# EAGLE design Qwiic_Relay_v11 (EAGLE 7.7.0)
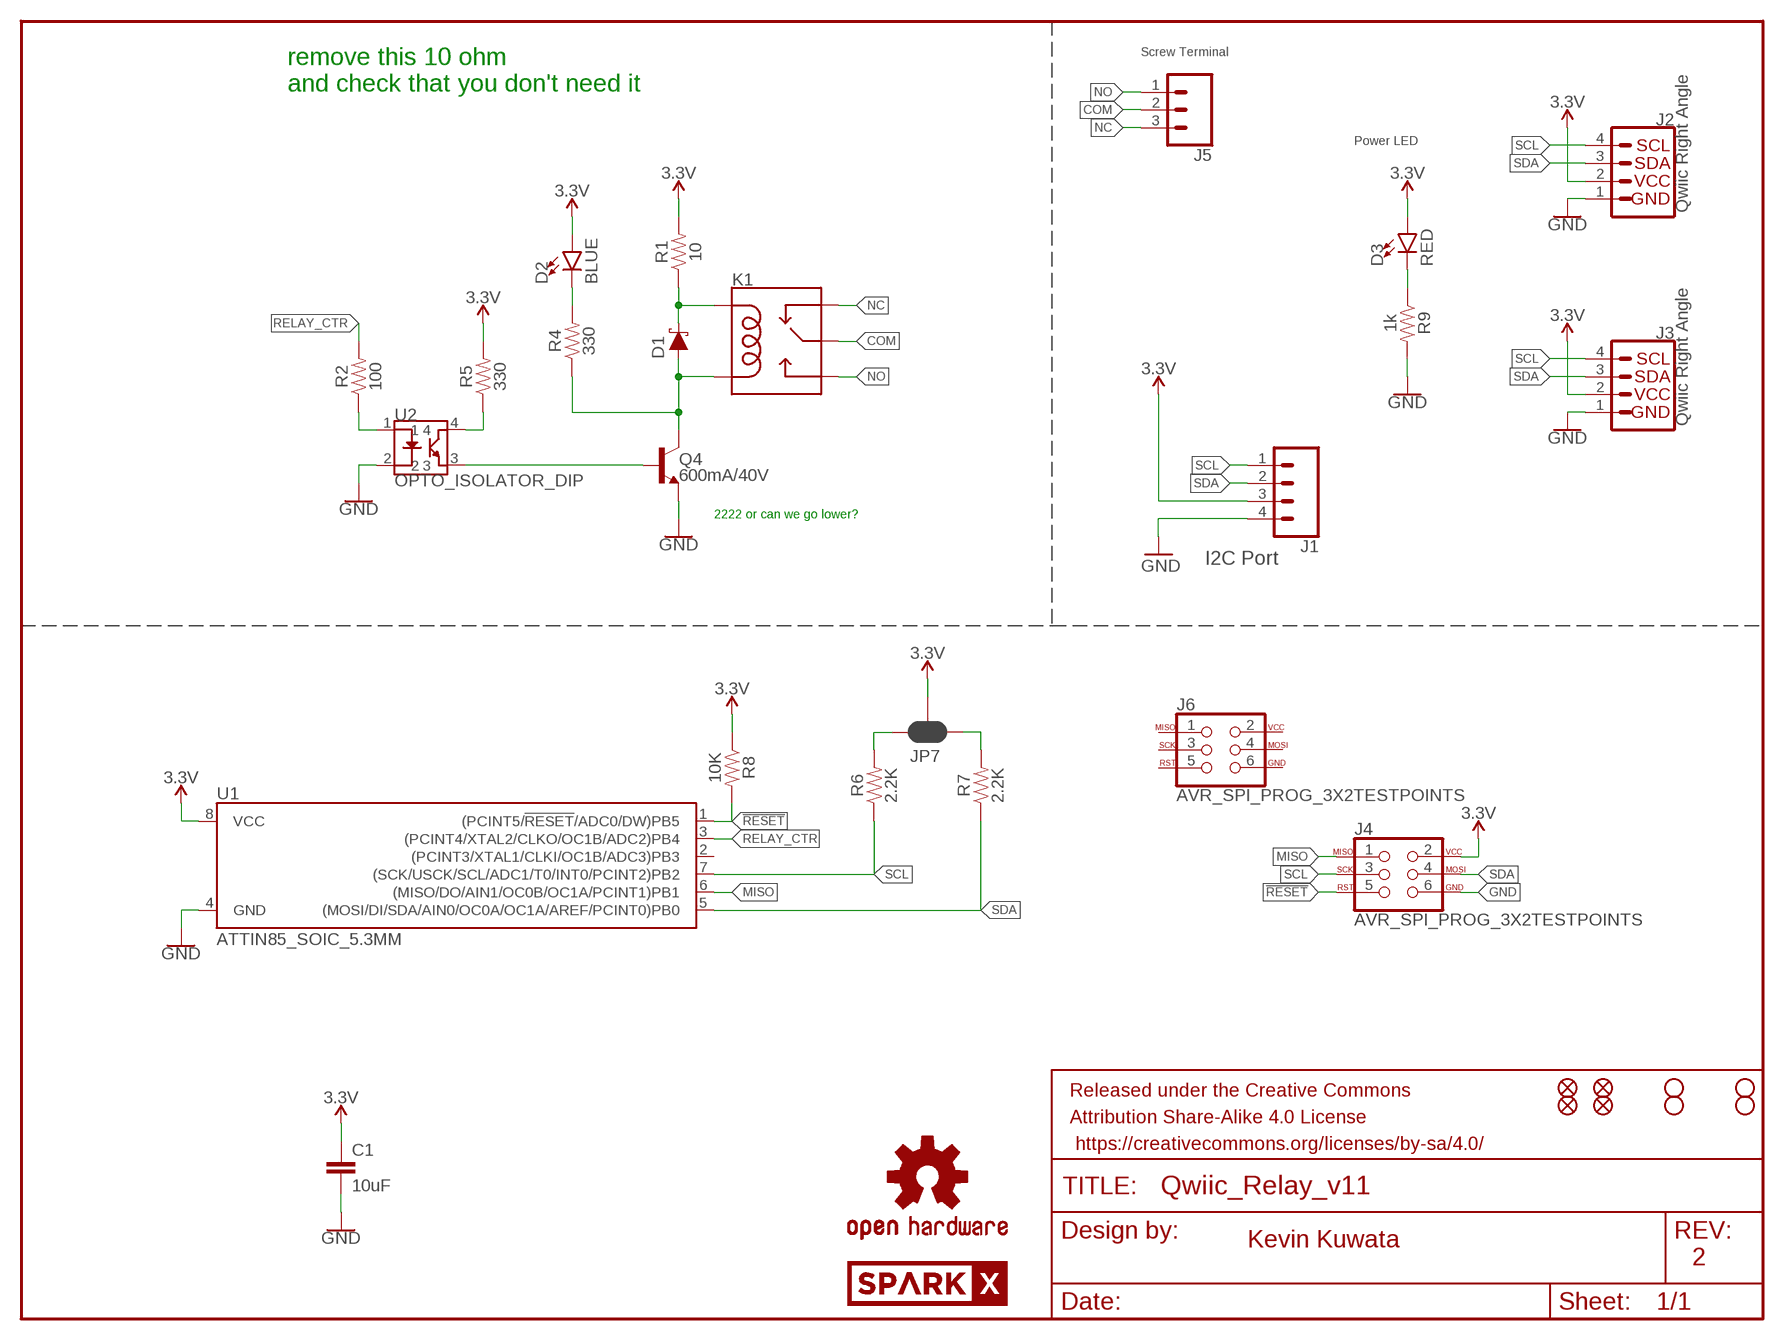
[diagram p0: schematic, sheet 1]

## Parts
C1  10uF  10UF-0603-6.3V-20%  [0603]
D1  1A/23V/620mV  DIODE-SCHOTTKY-BAT20J  [SOD-323]
D2  BLUE  LED-BLUE0603  [LED-0603]
D3  RED  LED-RED0603  [LED-0603]
FRAME1  FRAME-LETTER  [CREATIVE_COMMONS]
J1  CONN_041X04_NO_SILK  [1X04_NO_SILK]
J2  Qwiic Right Angle  I2C_STANDARDQWIIC  [1X04_1MM_RA]
J3  Qwiic Right Angle  I2C_STANDARDQWIIC  [1X04_1MM_RA]
J4  AVR_SPI_PROG_3X2TESTPOINTS  [2X3_TEST_POINTS]
J5  CONN_03-SCREW-5MM  [SCREWTERMINAL-5MM-3]
J6  AVR_SPI_PROG_3X2TESTPOINTS  [2X3_TEST_POINTS]
JP1  STAND-OFF  [STAND-OFF]
JP2  FIDUCIALUFIDUCIAL  [MICRO-FIDUCIAL]
JP3  STAND-OFF  [STAND-OFF]
JP4  STAND-OFF  [STAND-OFF]
JP5  STAND-OFF  [STAND-OFF]
JP6  FIDUCIALUFIDUCIAL  [MICRO-FIDUCIAL]
JP7  JUMPER-SMT_3_2-NC_PASTE_SILK  [SMT-JUMPER_3_2-NC_PASTE_SILK]
JP8  FIDUCIALUFIDUCIAL  [MICRO-FIDUCIAL]
JP9  FIDUCIALUFIDUCIAL  [MICRO-FIDUCIAL]
K1  RELAY_SPDT_1C  [RELAY_SPDT_1C]
LOGO1  OSHW-LOGOMINI  [OSHW-LOGO-MINI]
Q4  600mA/40V  TRANS_NPN-MMBT2222AL  [SOT23-3]
R1  10  47KOHM-0603-1/10W-1%  [0603]
R2  100  100OHM-0603-1/4W-5%  [0603]
R4  330  300OHM-0603-1/10W-1%  [0603]
R5  330  330OHM-0603-1/10W-1%  [0603]
R6  2.2K  4.7KOHM-0603-1/10W-1%  [0603]
R7  2.2K  4.7KOHM-0603-1/10W-1%  [0603]
R8  10K  330OHM-0603-1/10W-1%  [0603]
R9  1k  330OHM-0603-1/10W-1%  [0603]
U1  ATTIN85_SOIC_5.3MM  [ATTINY85]
U2  OPTO_ISOLATOR_DIP  [4PIN_DIP]
U$3  SPARKX-LOGO4  [SPARKX-MEDIUM]
U$4  SPARKX-LOGO4  [SPARKX-MEDIUM]

## Nets
3.3V: C1.1 D2.A D3.A J1.3 J2.2 J3.2 J4.2 JP7.2 R1.2 R5.2 R8.1 U1.8(VCC)
!RESET: J4.5 R8.2 U1.1((PCINT5/!RESET!/ADC0/DW)PB5)
COM: J5.2 K1.1(MAIN)
GND: C1.2 J1.4 J2.1 J3.1 J4.6 Q4.2(E) R9.2 U1.4(GND) U2.2
MISO: J4.1 U1.6((MISO/DO/AIN1/OC0B/OC1A/PCINT1)PB1)
N$1: Q4.1(B) U2.3
N$2: D1.A K1.5(COIL2) Q4.3(C) R4.1
N$3: R2.1 U2.1
N$4: JP7.1 R7.2
N$7: D1.C K1.2(COIL1) R1.1
N$8: D2.C R4.2
N$9: R5.1 U2.4
N$10: JP7.3 R6.2
N$13: D3.C R9.1
NC: J5.3 K1.4(NC)
NO: J5.1 K1.3(NO)
RELAY_CTR: R2.2 U1.3((PCINT4/XTAL2/CLKO/OC1B/ADC2)PB4)
SCL: J1.1 J2.4 J3.4 J4.3 R6.1 U1.7((SCK/USCK/SCL/ADC1/T0/INT0/PCINT2)PB2)
SDA: J1.2 J2.3 J3.3 J4.4 R7.1 U1.5((MOSI/DI/SDA/AIN0/OC0A/OC1A/AREF/PCINT0)PB0)
Unconnected: J6.1 J6.2 J6.3 J6.4 J6.5 J6.6 U1.2((PCINT3/XTAL1/CLKI/OC1B/ADC3)PB3)

## Notes on the sheet
- Screw Terminal
- remove this 10 ohm 
  and check that you don't need it
- Power LED
- 2222 or can we go lower?
- I2C Port
- Kevin Kuwata
- 2

## Library data of the parts
C1 = SparkFun-Capacitors:10UF: 10.0µF ceramic capacitors A capacitor is a passive two-terminal electrical component used to store electrical energy temporarily in an electric field.; PROD_ID: CAP-11015
D1 = SparkFun-DiscreteSemi:DIODE-SCHOTTKY: Schottky diode A Schottky diode is a semiconductor diode which has a low forward voltage drop and a very fast switching action.; PROD_ID: DIO-11623
D2 = SparkFun-LED:LED-BLUE: Blue SMD LED Used in manufacturing of various products at SparkFun Packages: 0603 - SMD 0603 package [Product Link] <http://www.digikey.com/product-detail/en/SMLE12BC7TT86/511-1589-2-ND/1641808> 1206 - SMD1206 package [Product Link] <http://www.digikey.com/product-detail/en/lite-on-inc/LTST-C150TBKT/160-1643-1-ND/573584> SparkFun Products: ESP8266 Thing-Dev Board <https://www.sparkfun.com/products/13711> RedBoard <https://www.sparkfun.com/products/12757>; PROD_ID: DIO-08575
D3 = SparkFun-LED:LED-RED: Red SMD LED Used in manufacturing of most products at SparkFun Packages: 0603 - SMD 0603 package [Product Link] <http://docs.avagotech.com/docs/AV02-0551EN> 0603 SMART - SMD 0603 SMART package ( more efficient and expensive)[Product Link] <http://www.osram-os.com/Graphics/XPic2/00077099_0.pdf> 1206 - SMD1206 package [Product Link] <https://www.sparkfun.com/datasheets/DevTools/LilyPad/Q150OVS4.pdff> SparkFun Products: Pro Mini 328 -5V <https://www.sparkfun.com/products/821> RedBoard <https://www.sparkfun.com/products/12757> IOIO-OTG <https://www.sparkfun.com/products/13613>; PROD_ID: DIO-00819
FRAME1 = SparkFun-Aesthetics:FRAME-LETTER: Schematic Frame - Letter Standard 8.5x11 US Letter frame
J1 = SparkFun-Connectors:CONN_04: Multi connection point. Often used as Generic Header-pin footprint for 0.1 inch spaced/style header connections On any of the 0.1 inch spaced packages, you can populate with these: Break Away Headers - Straight <https://www.sparkfun.com/products/116> (PRT-00116) Break Away Male Headers - Right Angle <https://www.sparkfun.com/products/553> (PRT-00553) Female Headers <https://www.sparkfun.com/products/115> (PRT-00115) Break Away Headers - Machine Pin <https://www.sparkfun.com/products/117> (PRT-00117) Break Away Female Headers - Swiss Machine Pin <https://www.sparkfun.com/products/743> (PRT-00743) For SCREWTERMINALS and SPRING TERMINALS visit here: Screw Terimnals on SparkFun.com <https://www.sparkfun.com/search/results?term=Screw+Terminals> (5mm/3.5mm/2.54mm spacing) This device is also useful as a general connection point to wire up your design to another part of your project. Our various solder wires solder well into these plated through hole pads. Hook-Up Wire - Assortment (Stranded, 22 AWG) <https://www.sparkfun.com/products/11375> (PRT-11375) Hook-Up Wire - Assortment (Solid Core, 22 AWG) <https://www.sparkfun.com/products/11367> (PRT-11367) View the entire wire category on our website here <https://www.sparkfun.com/categories/141> Special notes: Molex polarized connector foot print use with SKU : PRT-08231 with associated crimp pins and housings. 1MM SMD Version SKU: PRT-10208; PROD_ID: CONN-09696
J2 J3 = SparkFun-Connectors:I2C_STANDARD: SparkFun I2C Standard Pinout Header SparkFun has standardized on a pinout for all I2C based sensor breakouts. This pinout allows I2C boards to be plugged directly into the headers on Arduino Uno compatible boards, and to be daisy chained easily. Example SparkFun Products: SparkFun Atmospheric Sensor Breakout - BME280 <https://www.sparkfun.com/products/13676> SparkFun Altitude/Pressure Sensor Breakout - MPL3115A2 <https://www.sparkfun.com/products/11084> SparkFun TOF Range Finder Sensor - VL6180 <https://www.sparkfun.com/products/12785>; PROD_ID: CONN-13694
J4 J6 = SparkFun-Connectors:AVR_SPI_PROG_3X2: AVR ISP 6 Pin This is the reduced ISP connector for AVR programming. Common on Arduino. This footprint will take up less PCB space and can be used with a 10-pin to 6-pin adapter such as SKU: BOB-08508 **Special note about "TEST_POINT" package. The stop mask is on the top side, so if you want your programming test points to be on the bottom of your board, make sure to place this package on the bottom side of the board. This also ensure that the orientation to program from the bottom side will be correct. SparkFun Products: SparkFun ISP Pogo Adapter <https://www.sparkfun.com/products/11591> - NS Tiny AVR Programmer <https://www.sparkfun.com/products/11801> -PTH
J5 = SparkFun-Connectors:CONN_03: Multi connection point. Often used as Generic Header-pin footprint for 0.1 inch spaced/style header connections On any of the 0.1 inch spaced packages, you can populate with these: Break Away Headers - Straight <https://www.sparkfun.com/products/116> (PRT-00116) Break Away Male Headers - Right Angle <https://www.sparkfun.com/products/553> (PRT-00553) Female Headers <https://www.sparkfun.com/products/115> (PRT-00115) Break Away Headers - Machine Pin <https://www.sparkfun.com/products/117> (PRT-00117) Break Away Female Headers - Swiss Machine Pin <https://www.sparkfun.com/products/743> (PRT-00743) Stackable Header - 3 Pin (Female, 0.1") <https://www.sparkfun.com/products/13875> (PRT-13875) For SCREWTERMINALS and SPRING TERMINALS visit here: Screw Terimnals on SparkFun.com <https://www.sparkfun.com/search/results?term=Screw+Terminals> (5mm/3.5mm/2.54mm spacing) This device is also useful as a general connection point to wire up your design to another part of your project. Our various solder wires solder well into these plated through hole pads. Hook-Up Wire - Assortment (Stranded, 22 AWG) <https://www.sparkfun.com/products/11375> (PRT-11375) Hook-Up Wire - Assortment (Solid Core, 22 AWG) <https://www.sparkfun.com/products/11367> (PRT-11367) View the entire wire category on our website here <https://www.sparkfun.com/categories/141> Special notes: Molex polarized connector foot print use with SKU : PRT-08232 with associated crimp pins and housings.; PROD_ID: CONN-10134; SF_SKU: PRT-08433
JP1 JP3-JP5 = SparkFun:STAND-OFF: Stand Off This is the mechanical footprint for a #4 phillips button head screw. Use the keepout ring to avoid running the screw head into surrounding components. SKU : PRT-00447
JP2 JP6 JP8 JP9 = SparkFun:FIDUCIAL: Fiducial Alignment Points Various fiducial points for machine vision alignment.
JP7 = SparkFun-Jumpers:JUMPER-SMT_3_2-NC_PASTE: Normally closed solder jumper (2 of 2 connections) This jumper has an aperture in the stencil to allow solder paste to bridge both connections. Both connections are normally closed (NC). Wick off the solder to open the connection(s). Reapply solder to reclose the connection(s).
K1 = Relay_SPDT:RELAY_SPDT
LOGO1 = SparkFun-Aesthetics:OSHW-LOGO: Open-Source Hardware (OSHW) Logo This logo indicates the piece of hardware it is found on incorporates a OSHW license and/or adheres to the definition of open source hardware found here: http://freedomdefined.org/OSHW
Q4 = SparkFun-DiscreteSemi:TRANS_NPN: NPN transistor Current controlled devices typically used to amplify current or used as a switch. BC547 - COM-08928 <http://www.sparkfun.com/products/8928> (TO-92 45V 100mA) (1.Collector 2.Base 3.Emitter) 2N3904 - COM-00521 <http://www.sparkfun.com/products/521> (TO-92 40V 200mA) (1.Emitter 2.Base 3.Collector) P2N2222A - COM-12852 <http://www.sparkfun.com/products/12852> (TO-92 40V 600mA) (1.Collector 2.Base 3.Emitter); PROD_ID: TRANS-08049
R1 = SparkFun-Resistors:47KOHM: 47kΩ resistor A resistor is a passive two-terminal electrical component that implements electrical resistance as a circuit element. Resistors act to reduce current flow, and, at the same time, act to lower voltage levels within circuits. - Wikipedia; PROD_ID: RES-07871; VALUE: 47k
R2 = SparkFun-Resistors:100OHM: 100Ω resistor A resistor is a passive two-terminal electrical component that implements electrical resistance as a circuit element. Resistors act to reduce current flow, and, at the same time, act to lower voltage levels within circuits. - Wikipedia; PROD_ID: RES-12438
R4 = SparkFun-Resistors:300OHM: 300Ω resistor A resistor is a passive two-terminal electrical component that implements electrical resistance as a circuit element. Resistors act to reduce current flow, and, at the same time, act to lower voltage levels within circuits. - Wikipedia; PROD_ID: RES_10328; VALUE: 300
R5 = SparkFun-Resistors:330OHM: 330Ω resistor A resistor is a passive two-terminal electrical component that implements electrical resistance as a circuit element. Resistors act to reduce current flow, and, at the same time, act to lower voltage levels within circuits. - Wikipedia; PROD_ID: RES-00818
R6 R7 = SparkFun-Resistors:4.7KOHM: 4.7kΩ resistor A resistor is a passive two-terminal electrical component that implements electrical resistance as a circuit element. Resistors act to reduce current flow, and, at the same time, act to lower voltage levels within circuits. - Wikipedia; PROD_ID: RES-07857; VALUE: 4.7k
R8 R9 = SparkFun-Resistors:330OHM: 330Ω resistor A resistor is a passive two-terminal electrical component that implements electrical resistance as a circuit element. Resistors act to reduce current flow, and, at the same time, act to lower voltage levels within circuits. - Wikipedia; PROD_ID: RES-00818; VALUE: 330
U1 = attiny85:ATTIN85
U2 = LTV-816:OPTO_ISOLATOR
U$3 U$4 = SparkX:SPARKX-LOGO

## Board
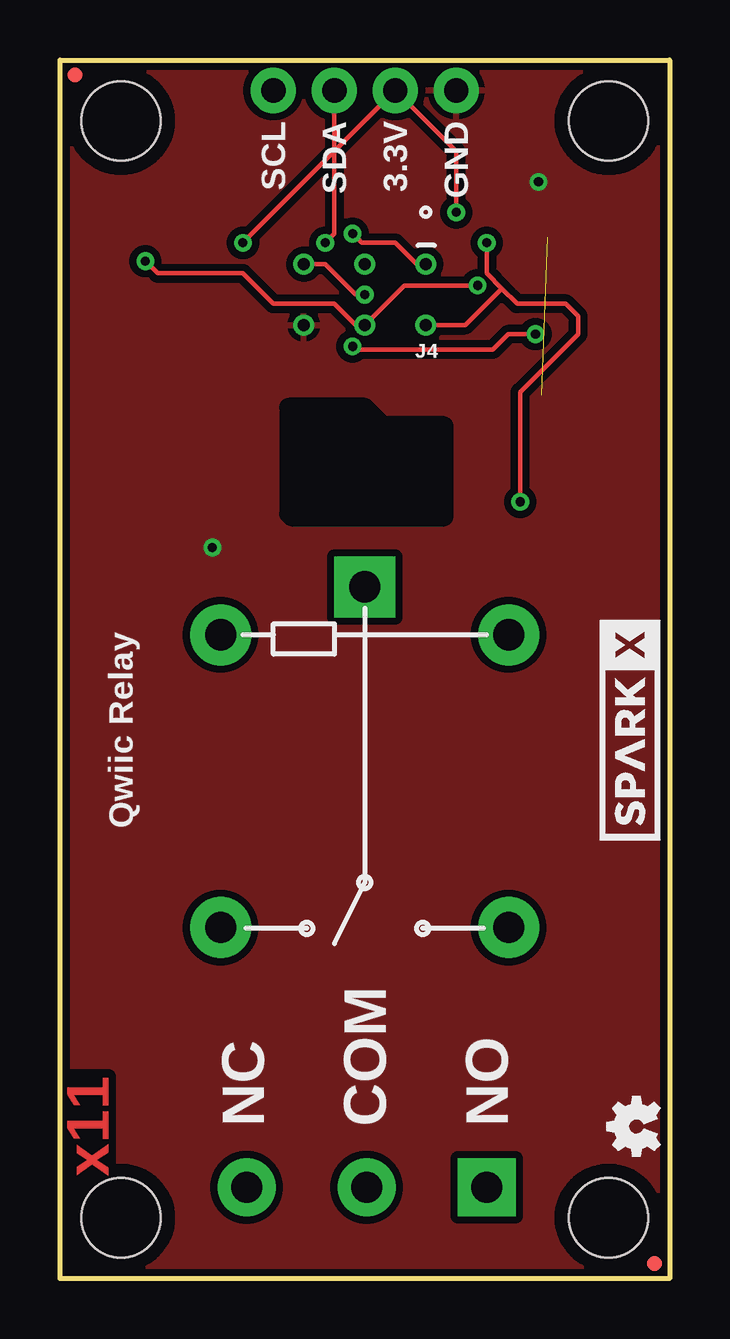
[diagram p1: board, top side]
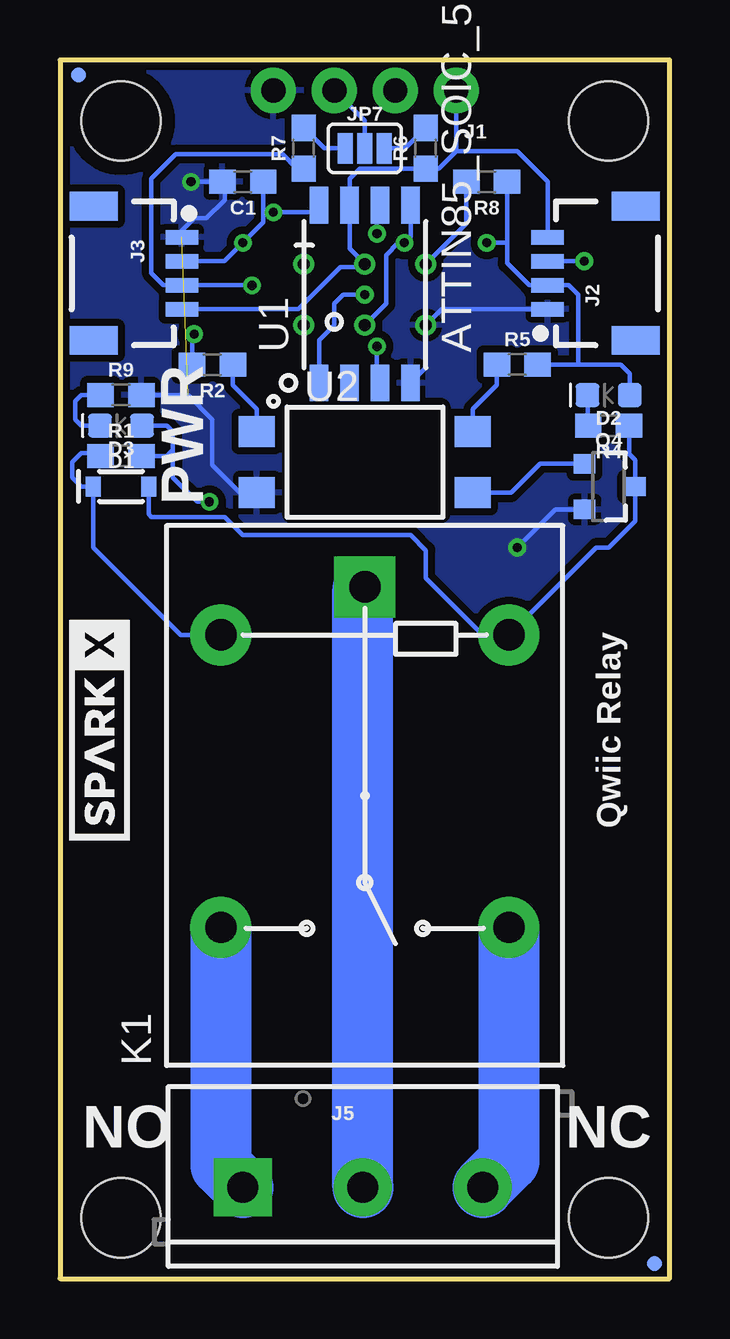
[diagram p2: board, bottom side, seen from below]

Size 25.4 x 50.8 mm. Coordinates in mm from the lower left corner, seen from the top.
Outline: 25.4,0 0,0 0,50.8 25.4,50.8 25.4,0
Copper layers (1*16): Top 0.035mm / dielectric 1.5mm / Bottom 0.035mm
Design rules "SparkFun-2-layer-PCBWay-LIMIT": minimum track width 6mil, minimum drill 0.3mm, track to track 6mil, track to pad 6mil, pad to pad 6mil, via to via 6mil, smd to smd 6mil, copper to edge 6mil, drill to drill 6mil, minimum pad ring 7mil, minimum via ring 7mil, stop-mask expansion 4mil, vias tented up to drill 25mil, thermal gap 10mil
bKeepout: area 9.5,31.8 to 15.7,35.7
tRestrict: area 9.5,31.8 to 16,36.3
bRestrict: area 9.5,31.9 to 16,36.3

### Footprints (pad centres in the part's own frame; a part is rotated, then mirrored left to right if it is on the bottom)
0603 = smd 1.1 x 1: 1 -0.85,0; 2 0.85,0
SOD-323 = smd 0.63 x 0.83: A 1.15,0; C -1.15,0
LED-0603 = smd 1 x 1: A -0.877,0; C 0.877,0
1X04_NO_SILK = drill 1.016 pad 1.88: 1 0,0; 2 2.54,0; 3 5.08,0; 4 7.62,0
1X04_1MM_RA = smd 0.6 x 1.35: 1 -1.5,0; 2 -0.5,0; 3 0.5,0; 4 1.5,0 | smd 1.2 x 2: NC1 2.8,-3.675; NC2 -2.8,-3.675
2X3_TEST_POINTS = drill 0.508: 1 -2.54,-1.27; 2 -2.54,1.27; 3 0,-1.27; 4 0,1.27; 5 2.54,-1.27; 6 2.54,1.27
SCREWTERMINAL-5MM-3 = drill 1.3 pad 2.413 square: 1 0,0 | drill 1.3 pad 2.413: 2 5,0; 3 10,0
STAND-OFF = hole 3.302: 0,0
MICRO-FIDUCIAL = smd 0.635 x 0.635: 1 0,0
SMT-JUMPER_3_2-NC_PASTE_SILK = smd 0.635 x 1.27: 1 -0.813,0; 2 0,0; 3 0.813,0
RELAY_SPDT_1C = drill 1.3 pad 2.54 square: 1 8.52,-0.005 | drill 1.3 pad 2.54: 2 6.52,5.995; 3 -5.68,5.995; 4 -5.68,-6.005; 5 6.52,-6.005
SOT23-3 = smd 0.8 x 0.9: 1 -0.95,-1; 2 0.95,-1; 3 0,1.1
ATTINY85 = smd 1.524 x 0.762: 1 -3.683,1.905; 2 -3.683,0.635; 3 -3.683,-0.635; 4 -3.683,-1.905; 5 3.727,-1.905; 6 3.727,-0.635; 7 3.727,0.635; 8 3.727,1.905
4PIN_DIP = smd 1.5 x 1.3: 1 -4.5,1.27; 2 -4.5,-1.27; 3 4.5,-1.27; 4 4.5,1.27

### Placement (x,y rotation side)
C1  17.78,45.72 180 bottom
D1  22.86,33.02 0 bottom
D2  2.54,36.83 180 bottom
D3  22.86,35.56 180 bottom
FRAME1  15.24,-16.51 0 bottom  (outside the outline)
J1  8.89,49.53 180 bottom
J2  5.08,41.91 90 bottom
J3  20.32,41.91 270 bottom
J4  12.7,41.02 180 top
J5  17.78,3.81 0 bottom
J6  -64.77,-24.13 0 top  (outside the outline)
JP1  22.86,2.54 0 bottom
JP2  0.63,50.16 0 top
JP3  22.86,48.26 0 bottom
JP4  2.54,48.26 0 bottom
JP5  2.54,2.54 0 bottom
JP6  24.76,0.64 0 top
JP7  12.7,47.12 0 bottom
JP8  0.63,0.64 0 bottom
JP9  24.64,50.16 0 bottom
K1  12.7,20.32 90 bottom
LOGO1  24,6.35 90 top
Q4  2.54,33.02 270 bottom
R1  22.86,34.29 0 bottom
R2  19.05,38.1 180 bottom
R4  2.54,35.56 180 bottom
R5  6.35,38.1 0 bottom
R6  10.16,47.12 90 bottom
R7  15.24,47.12 90 bottom
R8  7.62,45.72 180 bottom
R9  22.86,36.83 0 bottom
U1  12.7,41.02 90 bottom
U2  12.7,34.04 0 bottom
U$3  23.75,22.86 90 bottom
U$4  23.75,22.86 90 top

### Tracks (layer width: path | path; a pad name or v marks a point on that pad's centre or on a via)
3.3V  (via drill 0.38)
  Top 0.178: v19.18,32.38 19.18,36.96 21.59,39.37 21.59,40.13 21.08,40.64 19.05,40.64 18.41,41.27 | v17.78,43.18 17.78,41.91 18.41,41.27 | J4.2 16.89,39.75 18.41,41.27 | v7.62,43.18 J1.3 16.51,46.99 v16.51,44.45
  Bottom 0.178: R5.2 3.81,38.1 | 3.81,38.1 2.03,38.1 1.66,37.73 D2.A | J3.2 18.55,42.41 v17.78,43.18 16.93,44.03 16.93,44.45 | C1.1 16.93,44.45 | R1.2 20.95,34.29 20.7,34.54 | 20.7,34.54 20.7,35.31 20.95,35.56 D3.A | 20.7,34.54 20.7,33.4 19.68,32.38 v19.18,32.38 | 3.81,38.1 3.81,41.02 4.2,41.41 J2.2 5.85,41.41 6.77,42.33 R8.1 6.77,43.18 v7.62,43.18 | J1.3 12.7,48.26 JP7.2 | U1.8 14.9,44.45 v16.51,44.45 16.93,44.45
!RESET  (via drill 0.38)
  Top 0.178: J4.5 11.05,42.29 12.32,41.02 v12.7,41.02
  Bottom 0.178: R8.2 8.47,43.98 J4.5 | U1.1 14.6,39.12 13.97,39.75 13.97,40.64 13.59,41.02 v12.7,41.02
COM
  Bottom 2.54: J5.2 12.78,28.75 K1.1
GND  (via drill 0.38)  (1 unrouted)
  Bottom 0.178: U1.4 10.16,37.97 J4.6 9.5,40.41 J2.1 | U2.2 17.91,32.77 19.05,33.91 19.05,35.81 20.07,36.83 R9.2 | Q4.2 4.76,32.07 v6.35,30.48 | J3.1 20.32,43.69 19.81,44.2 19.3,44.2 18.54,44.96 18.54,45.63 C1.2 v19.94,45.72
  pour Bottom (isolate 0.305): 25.4,0 25.4,50.8 0,50.8 0,0
  pour Top (isolate 0.305): 25.4,0 0,0 0,50.8 25.4,50.8
MISO  (via drill 0.38)
  Top 0.178: v12.19,43.56 12.57,43.18 13.97,43.18 14.86,42.29 J4.1
  Bottom 0.178: U1.6 12.19,44.62 v12.19,43.56
N$1
  Bottom 0.178: U2.3 6.6,32.77 5.4,33.97 Q4.1
N$2
  Bottom 0.178: D1.A 21.71,31.87 21.59,31.75 18.54,31.75 17.78,30.99 10.79,30.99 10.16,30.35 10.16,29.21 7.79,26.84 K1.5 3.05,30.48 2.54,30.48 1.44,31.58 Q4.3 1.44,34.12 1.69,34.37 R4.1
N$3
  Bottom 0.178: R2.1 18.2,37.25 17.2,36.25 U2.1
N$4
  Bottom 0.178: JP7.1 14.39,47.12 R7.2
N$7
  Bottom 0.178: R1.1 23.84,34.42 24.51,34.42 24.89,34.04 24.89,33.4 24.51,33.02 D1.C 24.01,30.49 20.36,26.84 K1.2
N$8
  Bottom 0.178: D2.C 3.42,35.59 R4.2
N$9
  Bottom 0.178: U2.4 8.2,36.25 7.2,37.25 R5.1
N$10
  Bottom 0.178: JP7.3 11.01,47.12 R6.2
N$13
  Bottom 0.178: D3.C 24.51,35.56 24.76,35.81 24.76,36.58 24.51,36.83 R9.1
NC
  Bottom 2.54: K1.4 6.7,4.89 J5.3
NO
  Bottom 2.54: K1.3 18.7,4.72 J5.1
RELAY_CTR  (via drill 0.38)
  Top 0.178: v19.81,39.37 18.67,39.37 18.03,38.73 12.32,38.73 v12.19,38.86
  Bottom 0.178: R2.2 19.9,39.28 v19.81,39.37 | v12.19,38.86 12.19,37.47 U1.3
SCL
  Bottom 0.178: 8.89,46.99 9.61,46.27 R6.1 12.91,46.27 13.33,45.85 U1.7 13.33,42.93 J4.3 12.83,42.16 13.72,42.16 15.47,40.41 J3.4 | 8.89,46.99 J1.1 | 8.89,46.99 6.35,46.99 5.08,45.72 J2.4
SDA  (via drill 0.38)
  Top 0.178: v3.56,42.42 4.06,41.91 7.62,41.91 8.89,40.64 11.43,40.64 12.32,39.75 J4.4 14.35,41.4 v17.4,41.4 | J1.2 11.43,43.56 v11.05,43.18
  Bottom 0.178: J4.4 11.81,40.64 11.81,42.67 11.3,43.18 v11.05,43.18 10.79,43.43 U1.5 | 5.58,42.41 5.57,42.42 v3.56,42.42 | v17.4,41.4 v17.41,41.41 J3.3 21.09,41.41 21.59,41.91 21.59,45.85 20.57,46.86 16.13,46.86 15.53,46.27 R7.1
  Bottom 0.254: J2.3 5.58,42.41

### Text on the board
Top: x11
tPlace: SCL | SDA | 3.3V | GND | Qwiic Relay | NC | COM | NO
bPlace: PWR | Qwiic Relay | NC | NO
bDocu: Max Current 5.5 amp / 100 mil width / 15 *C Rise / 1 Oz Cu | Kevin Kuwata